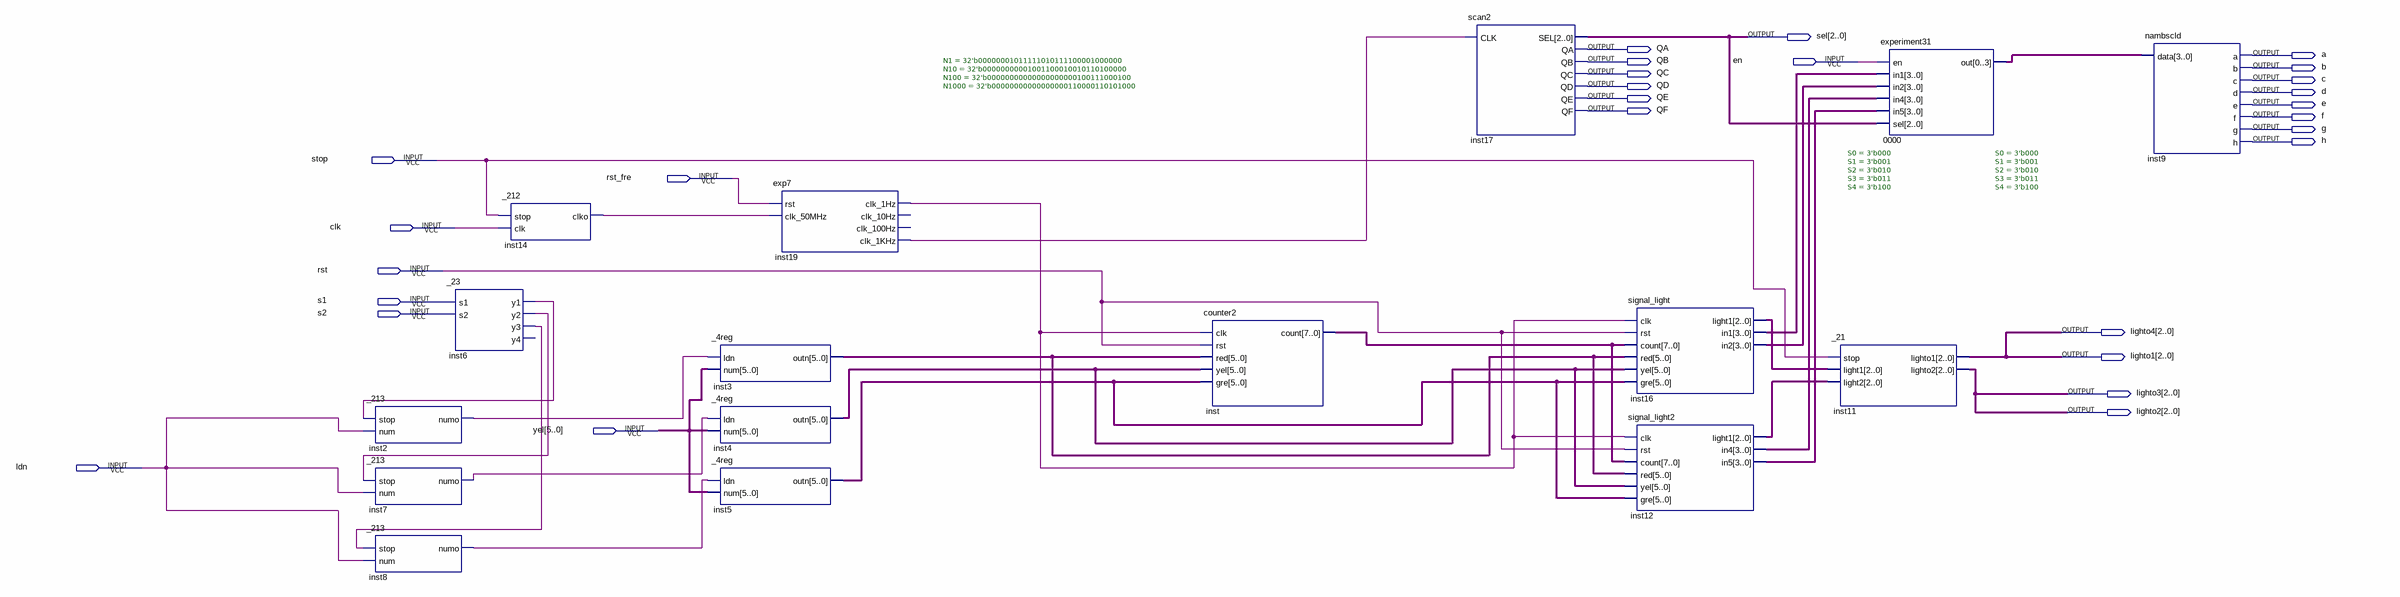
[diagram p0: schematic sheet]
// Quartus schematic redw.bdf as structural Verilog: 16 symbols, 28 pins
module redw (
  input  en,
  input  stop,
  input  rst_fre,
  input  clk,
  input  rst,
  input  s1,
  input  s2,
  input  [5:0] yel,
  input  ldn,
  output [2:0] sel,
  output QA,
  output a,
  output QB,
  output b,
  output QC,
  output c,
  output QD,
  output d,
  output QE,
  output e,
  output QF,
  output f,
  output g,
  output h,
  output [2:0] lighto4,
  output [2:0] lighto1,
  output [2:0] lighto3,
  output [2:0] lighto2
);

  wire inst2_numo, inst6_y1, inst6_y2, inst6_y3, inst7_numo, inst8_numo, inst14_clko, inst19_clk_1hz,
       inst19_clk_1khz;
  wire [2:0] inst12_light1, inst16_light1;
  wire [3:0] inst12_in4, inst12_in5, inst16_in1, inst16_in2, n0000_out;
  wire [5:0] inst3_outn, inst4_outn, inst5_outn;
  wire [7:0] inst_count;

  _213 inst2 (.stop(inst6_y1), .num(ldn), .numo(inst2_numo));
  _213 inst7 (.stop(inst6_y2), .num(ldn), .numo(inst7_numo));
  _213 inst8 (.stop(inst6_y3), .num(ldn), .numo(inst8_numo));
  _23 inst6 (.s1(s1), .s2(s2), .y1(inst6_y1), .y2(inst6_y2), .y3(inst6_y3));  // open: y4
  _212 inst14 (.stop(stop), .clk(clk), .clko(inst14_clko));
  _4reg inst3 (.ldn(inst2_numo), .num(yel), .outn(inst3_outn));
  _4reg inst4 (.ldn(inst7_numo), .num(yel), .outn(inst4_outn));
  _4reg inst5 (.ldn(inst8_numo), .num(yel), .outn(inst5_outn));
  exp7 #(.N1(32'b00000001011111010111100001000000), .N10(32'b00000000001001100010010110100000), .N100(32'b00000000000000000000100111000100), .N1000(32'b00000000000000000110000110101000)) inst19 (
    .rst(rst_fre), .clk_50MHz(inst14_clko), .clk_1Hz(inst19_clk_1hz), .clk_1KHz(inst19_clk_1khz));  // open: clk_10Hz, clk_100Hz
  counter2 inst (
    .clk(inst19_clk_1hz), .rst(rst), .red(inst3_outn), .yel(inst4_outn), .gre(inst5_outn), .count(inst_count));
  scan2 inst17 (.CLK(inst19_clk_1khz), .SEL(sel), .QA(QA), .QB(QB), .QC(QC), .QD(QD), .QE(QE), .QF(QF));
  signal_light #(.S0(3'b000), .S1(3'b001), .S2(3'b010), .S3(3'b011), .S4(3'b100)) inst16 (
    .clk(inst19_clk_1hz), .rst(rst), .count(inst_count), .red(inst3_outn), .yel(inst4_outn),
    .gre(inst5_outn), .light1(inst16_light1), .in1(inst16_in1), .in2(inst16_in2));
  signal_light2 #(.S0(3'b000), .S1(3'b001), .S2(3'b010), .S3(3'b011), .S4(3'b100)) inst12 (
    .clk(inst19_clk_1hz), .rst(rst), .count(inst_count), .red(inst3_outn), .yel(inst4_outn),
    .gre(inst5_outn), .light1(inst12_light1), .in4(inst12_in4), .in5(inst12_in5));
  _21 inst11 (.stop(stop), .light1(inst16_light1), .light2(inst12_light1), .lighto1(lighto1), .lighto2(lighto2));
  experiment31 u_0000 (
    .en(en), .in1(inst16_in1), .in2(inst16_in2), .in4(inst12_in4), .in5(inst12_in5), .sel(sel),
    .out(n0000_out));
  nambscld inst9 (.data(n0000_out), .a(a), .b(b), .c(c), .d(d), .e(e), .f(f), .g(g), .h(h));

  assign lighto3 = lighto2;
  assign lighto4 = lighto1;
endmodule
